# Altium schematic sheet PLC out.SchDoc: Enclosure PLC outputs
size A4; Author: Felipe Besser P.; CompanyName: Observatorio Las Campanas; DrawnBy: Felipe Besser P.; DocumentNumber: 3; Revision: 1; SheetNumber: 2; SheetTotal: 3
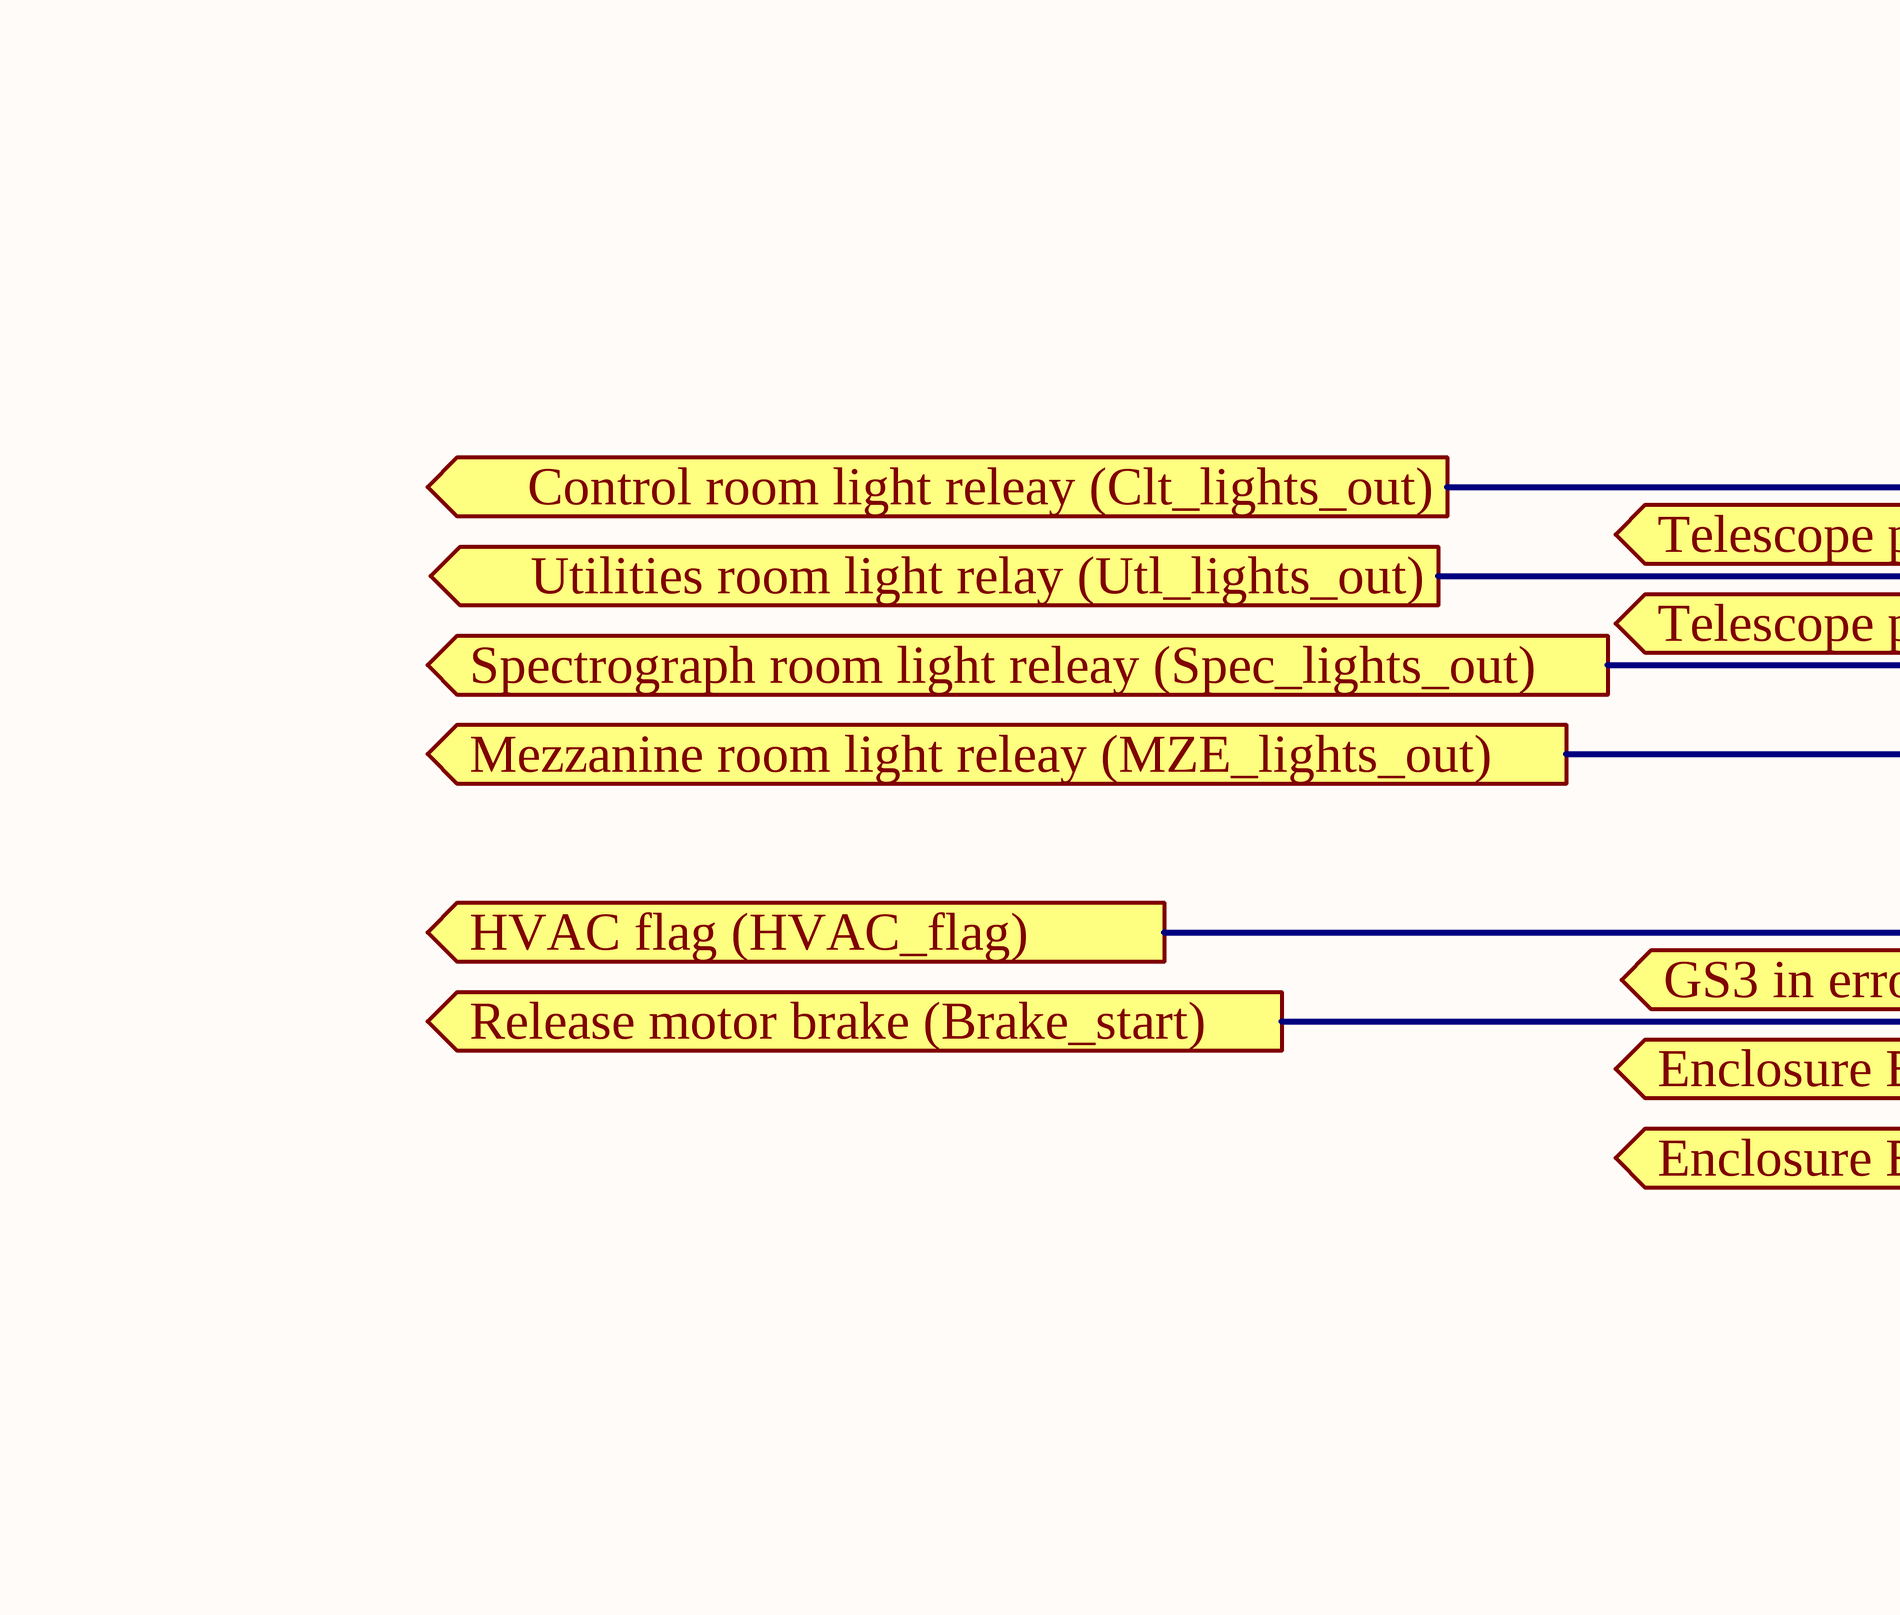
[diagram p0: PLC out.SchDoc, bottom column 3 of 4]
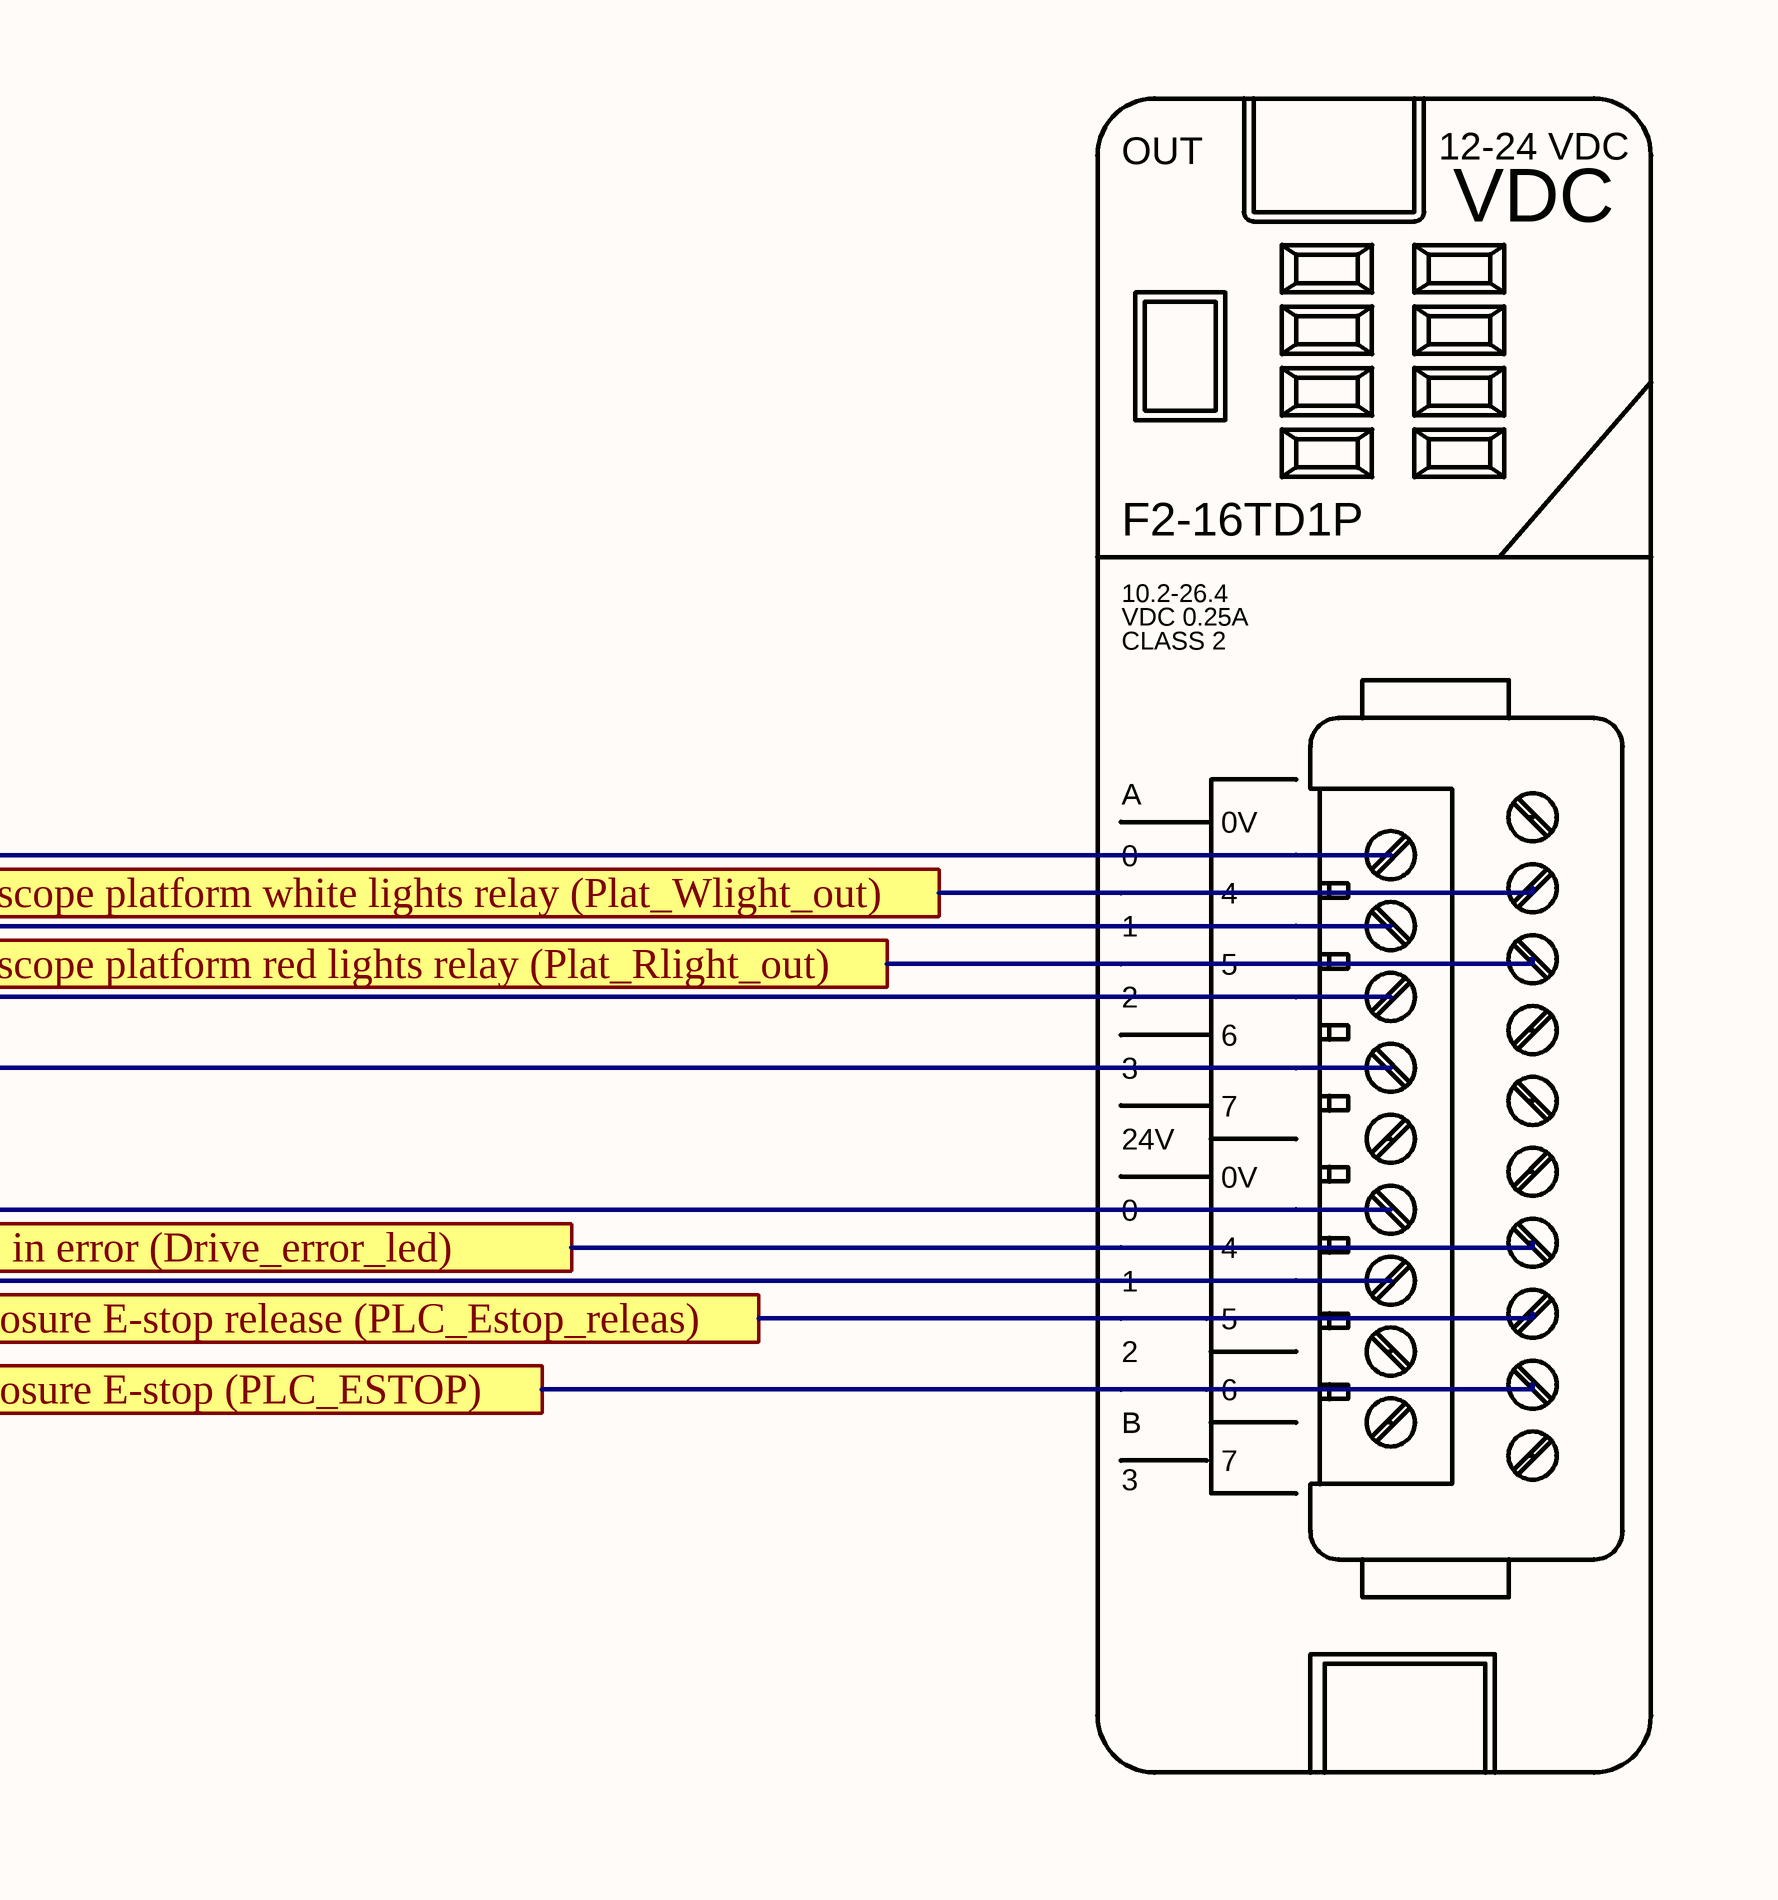
[diagram p1: PLC out.SchDoc, bottom column 4 of 4]

## Parts
*  F2-16TD1P  (value not drawn)

## Ports
Control room light releay (Clt_lights_out) (out), Enclosure E-stop (PLC_ESTOP) (out), Enclosure E-stop release (PLC_Estop_releas) (out), GS3 in error (Drive_error_led) (out), HVAC flag (HVAC_flag) (out), Mezzanine room light releay (MZE_lights_out) (out), Release motor brake (Brake_start) (out), Spectrograph room light releay (Spec_lights_out) (out), Telescope platform red lights relay (Plat_Rlight_out) (out), Telescope platform white lights relay (Plat_Wlight_out) (out), Utilities room light relay (Utl_lights_out) (out)

## Nets
Control room light releay (Clt_lights_out): *.?1(A0) ; port Control room light releay (Clt_lights_out)
Enclosure E-stop (PLC_ESTOP): *.?17(B6) ; port Enclosure E-stop (PLC_ESTOP)
Enclosure E-stop release (PLC_Estop_releas): *.?15(B5) ; port Enclosure E-stop release (PLC_Estop_releas)
GS3 in error (Drive_error_led): *.?13(B4) ; port GS3 in error (Drive_error_led)
HVAC flag (HVAC_flag): *.?11(B0) ; port HVAC flag (HVAC_flag)
Mezzanine room light releay (MZE_lights_out): *.?7(A3) ; port Mezzanine room light releay (MZE_lights_out)
Release motor brake (Brake_start): *.?12(B1) ; port Release motor brake (Brake_start)
Spectrograph room light releay (Spec_lights_out): *.?5(A2) ; port Spectrograph room light releay (Spec_lights_out)
Telescope platform red lights relay (Plat_Rlight_out): *.?4(A5) ; port Telescope platform red lights relay (Plat_Rlight_out)
Telescope platform white lights relay (Plat_Wlight_out): *.?3(A4) ; port Telescope platform white lights relay (Plat_Wlight_out)
Utilities room light relay (Utl_lights_out): *.?2(A1) ; port Utilities room light relay (Utl_lights_out)

Not connected (* = marked no-connect by the designer): * ?6(A6) ?8(A7) ?9(24V) ?10(0V) ?14(B2) ?16(B3) ?18(B7) ?19(0V)

## Notes on the sheet
- (in symbol F2-16TD1P) 12-24 VDC; OUT; VDC; 10.2-26.4; VDC 0.25A; CLASS 2; A; 0; 4; 1; 5; 2; 6; 3; 7; B